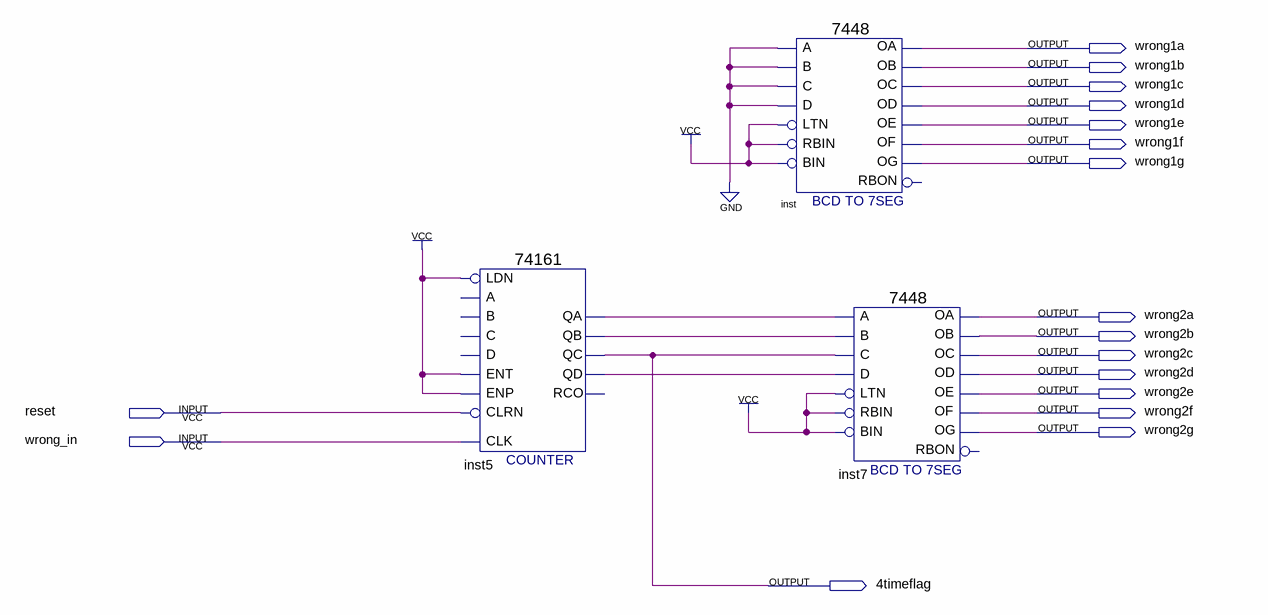
[diagram p0: schematic sheet]
// Quartus schematic wrongcount.bdf as structural Verilog: 3 symbols, 17 pins
module wrongcount (
  input  reset,
  input  wrong_in,
  output wrong1a,
  output wrong1b,
  output wrong1c,
  output wrong1d,
  output wrong1e,
  output wrong1f,
  output wrong1g,
  output wrong2a,
  output wrong2b,
  output wrong2c,
  output wrong2d,
  output wrong2e,
  output wrong2f,
  output wrong2g,
  output \4timeflag 
);

  wire inst5_qa, inst5_qb, inst5_qd;

  \74161  inst5 (
    .CLRN(reset), .CLK(wrong_in), .ENP(1'b1), .LDN(1'b1), .ENT(1'b1), .QD(inst5_qd), .QC(\4timeflag ),
    .QB(inst5_qb), .QA(inst5_qa));  // open: A, D, B, C, RCO
  \7448  inst (
    .A(1'b0), .C(1'b0), .D(1'b0), .B(1'b0), .RBIN(1'b1), .BIN(1'b1), .LTN(1'b1), .OC(wrong1c), .OE(wrong1e),
    .OD(wrong1d), .OF(wrong1f), .OG(wrong1g), .OB(wrong1b), .OA(wrong1a));  // open: RBON
  \7448  inst7 (
    .A(inst5_qa), .C(\4timeflag ), .D(inst5_qd), .B(inst5_qb), .RBIN(1'b1), .BIN(1'b1), .LTN(1'b1),
    .OC(wrong2c), .OE(wrong2e), .OD(wrong2d), .OF(wrong2f), .OG(wrong2g), .OB(wrong2b), .OA(wrong2a));  // open: RBON
endmodule
